# Altium project lcd_ctrl_block_diagram.PrjPcb
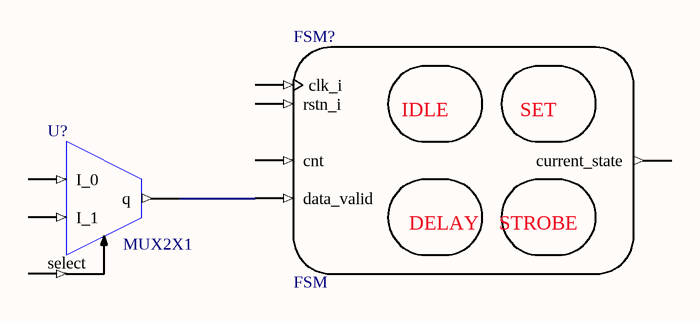
[diagram p0: lcd_ctrl_block_diagram.SchDoc]
1 sheet, 2 parts. Net scope: global (net labels, ports and power ports of the same name join across sheets).

## Sheet lcd_ctrl_block_diagram.SchDoc
size A4

### Parts
FSM?  FSM
U?  MUX2X1

### Nets
NetFSM?_data_valid: FSM?.data_valid U?.q

Not connected (* = marked no-connect by the designer): FSM? clk_i cnt[1..0](cnt) current_state[1:0](current_state) rstn_i; U? I_0 I_1 select

### Notes on the sheet
- (in symbol FSM_1) IDLE; SET; DELAY; STROBE

### Library data of the parts
FSM? = FSM_1
U? = MUX_2X1